# Altium project SAMA7D65-Curiosity.PrjPcb (part 5 of 12)

## Sheet 08 - Memories.SchDoc
size B; CompanyName: Microchip Technology Inc.; Organization: Microchip Technology; Address1: 2355 West Chandler Blvd.; Address2: Chandler, AZ  85224; Address4: USA; DocumentNumber: 8; SheetNumber: 8; SheetTotal: 15; SheetTitle: NAND, QSPI Flash Memories, SD Card
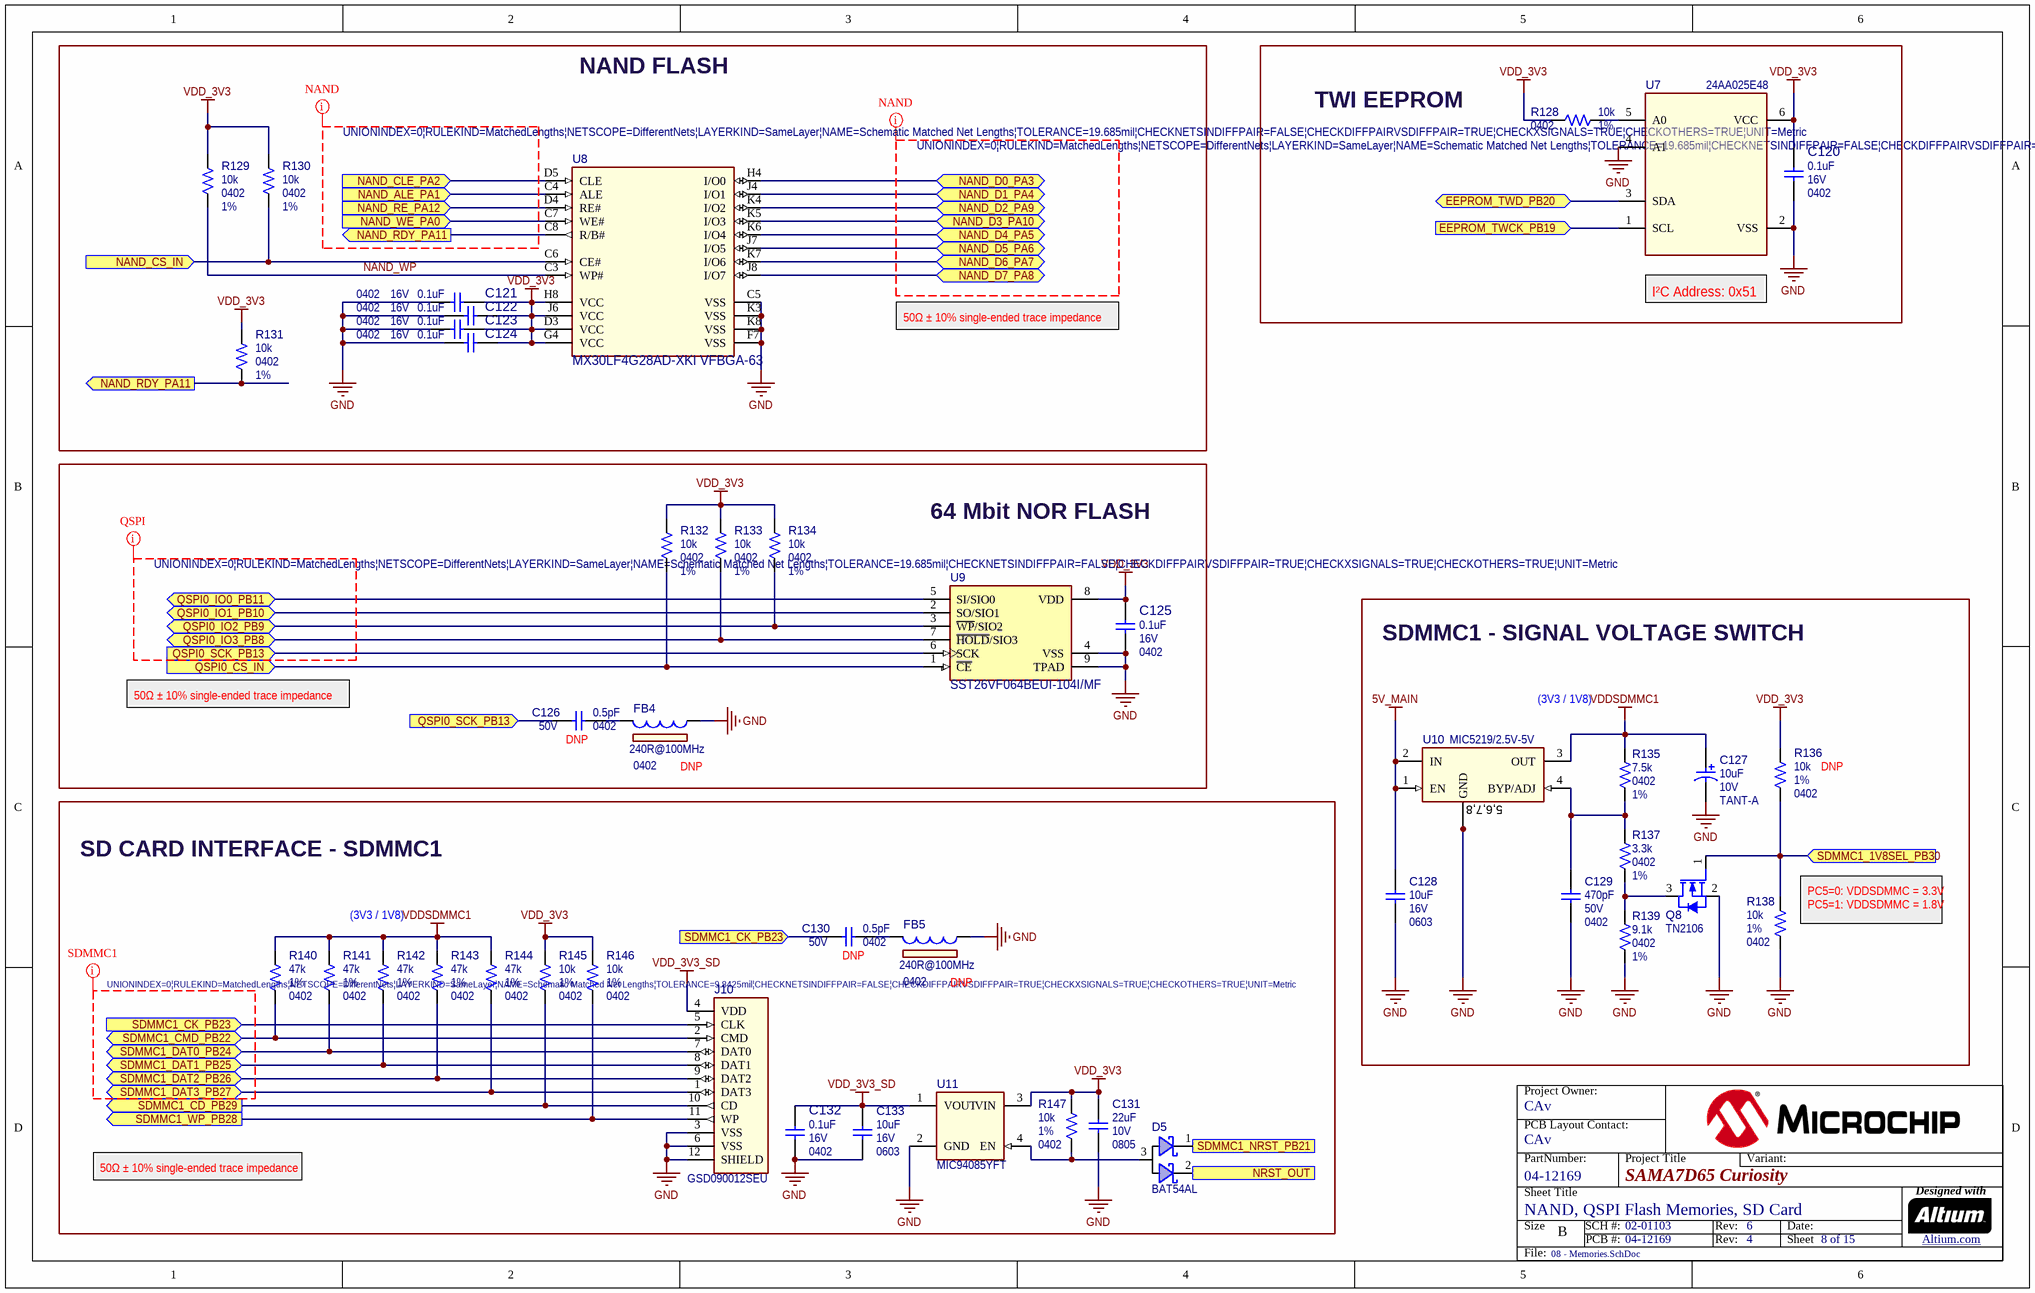
[diagram p7: 08 - Memories.SchDoc]

### Parts
C120  value 0.1uF  Voltage: 16V  Package: 0402  [CAP_C_0402]  (hidden comment: Capacitor NP)
C121  value 0.1uF  Voltage: 16V  Package: 0402  [CAP_C_0402]  (hidden comment: Capacitor NP)
C122  value 0.1uF  Voltage: 16V  Package: 0402  [CAP_C_0402]  (hidden comment: Capacitor NP)
C123  value 0.1uF  Voltage: 16V  Package: 0402  [CAP_C_0402]  (hidden comment: Capacitor NP)
C124  value 0.1uF  Voltage: 16V  Package: 0402  [CAP_C_0402]  (hidden comment: Capacitor NP)
C125  value 0.1uF  Voltage: 16V  Package: 0402  [CAP_C_0402]  (hidden comment: Capacitor NP)
C126  value 0.5pF  Voltage: 50V  Package: 0402  Populated: DNP  [CAP_C_0402]  (hidden comment: Capacitor NP)
C127  value 10uF  Voltage: 10V  Package: TANT-A  [CAP_TANT_A]  (hidden comment: Capacitor POL)
C128  value 10uF  Voltage: 16V  Package: 0603  [CAP_C_0603]  (hidden comment: Capacitor NP)
C129  value 470pF  Voltage: 50V  Package: 0402  [CAP_C_0402]  (hidden comment: Capacitor NP)
C130  value 0.5pF  Voltage: 50V  Package: 0402  Populated: DNP  [CAP_C_0402]  (hidden comment: Capacitor NP)
C131  value 22uF  Voltage: 10V  Package: 0805  [CAP_C_0805]  (hidden comment: Capacitor NP)
C132  value 0.1uF  Voltage: 16V  Package: 0402  [CAP_C_0402]  (hidden comment: Capacitor NP)
C133  value 10uF  Voltage: 16V  Package: 0603  [CAP_C_0603]  (hidden comment: Capacitor NP)
D5  value BAT54AL  [SOT-23-3]  (hidden comment: Diode Schottky Dual CA)
FB4  value 240R@100MHz  Package: 0402  Populated: DNP  [IND_C_0402]  (hidden comment: Ferrite Bead)
FB5  value 240R@100MHz  Package: 0402  Populated: DNP  [IND_C_0402]  (hidden comment: Ferrite Bead)
J10  Manufacturer Part Number 1: GSD090012SEU  [CON_SD_GSD090012SEU]  (hidden comment: SD-114-00841-68)
Q8  value TN2106  [SOT-23-3]  (hidden comment: Transistor MOS-N GSD)
R128  value 10k  Package: 0402  Tolerance: 1%  [RES_C_0402]  (hidden comment: Resistor)
R129  value 10k  Package: 0402  Tolerance: 1%  [RES_C_0402]  (hidden comment: Resistor)
R130  value 10k  Package: 0402  Tolerance: 1%  [RES_C_0402]  (hidden comment: Resistor)
R131  value 10k  Package: 0402  Tolerance: 1%  [RES_C_0402]  (hidden comment: Resistor)
R132  value 10k  Package: 0402  Tolerance: 1%  [RES_C_0402]  (hidden comment: Resistor)
R133  value 10k  Package: 0402  Tolerance: 1%  [RES_C_0402]  (hidden comment: Resistor)
R134  value 10k  Package: 0402  Tolerance: 1%  [RES_C_0402]  (hidden comment: Resistor)
R135  value 7.5k  Package: 0402  Tolerance: 1%  [RES_C_0402]  (hidden comment: Resistor)
R136  value 10k  Package: 0402  Tolerance: 1%  Populated: DNP  [RES_C_0402]  (hidden comment: Resistor)
R137  value 3.3k  Package: 0402  Tolerance: 1%  [RES_C_0402]  (hidden comment: Resistor)
R138  value 10k  Package: 0402  Tolerance: 1%  [RES_C_0402]  (hidden comment: Resistor)
R139  value 9.1k  Package: 0402  Tolerance: 1%  [RES_C_0402]  (hidden comment: Resistor)
R140  value 47k  Package: 0402  Tolerance: 1%  [RES_C_0402]  (hidden comment: Resistor)
R141  value 47k  Package: 0402  Tolerance: 1%  [RES_C_0402]  (hidden comment: Resistor)
R142  value 47k  Package: 0402  Tolerance: 1%  [RES_C_0402]  (hidden comment: Resistor)
R143  value 47k  Package: 0402  Tolerance: 1%  [RES_C_0402]  (hidden comment: Resistor)
R144  value 47k  Package: 0402  Tolerance: 1%  [RES_C_0402]  (hidden comment: Resistor)
R145  value 10k  Package: 0402  Tolerance: 1%  [RES_C_0402]  (hidden comment: Resistor)
R146  value 10k  Package: 0402  Tolerance: 1%  [RES_C_0402]  (hidden comment: Resistor)
R147  value 10k  Package: 0402  Tolerance: 1%  [RES_C_0402]  (hidden comment: Resistor)
U7  value 24AA025E48  [SOT-23-6]  (hidden comment: 24XXXX SOT-23-6)
U8  MX30LF4G28AD-XKI VFBGA-63  [VFBGA-63_P0.8_9x11x1]
U9  value SST26VF064BEUI-104I/MF  [WSON-8_6x5_EP3.4X4.0]  (hidden comment: SST26VF064B-104IMF)
U10  value MIC5219/2.5V-5V  [MSOP-8]  (hidden comment: MIC5219 MSOP-8)
U11  value MIC94085YFT  [MLF-4 0.85X0.85mm]  (hidden comment: MIC94085YFT MLF-4)

### Blocks framed on the sheet
NAND FLASH: C121-C124 R129-R131 U8
TWI EEPROM: C120 R128 U7
64 Mbit NOR FLASH: C125 C126 FB4 R132-R134 U9
SDMMC1 - SIGNAL VOLTAGE SWITCH: C127-C129 Q8 R135-R139 U10
SD CARD INTERFACE - SDMMC1: C130-C133 D5 FB5 J10 R140-R147 U11

### Ports
EEPROM_TWCK_PB19 (in), EEPROM_TWD_PB20 (bidir), NAND_ALE_PA1 (in), NAND_CLE_PA2 (in), NAND_CS_IN (in), NAND_D0_PA3 (bidir), NAND_D1_PA4 (bidir), NAND_D2_PA9 (bidir), NAND_D3_PA10 (bidir), NAND_D4_PA5 (bidir), NAND_D5_PA6 (bidir), NAND_D6_PA7 (bidir), NAND_D7_PA8 (bidir), NAND_RDY_PA11 (out), NAND_RE_PA12 (in), NAND_WE_PA0 (in), NRST_OUT (in), QSPI0_CS_IN (in), QSPI0_IO0_PB11 (bidir), QSPI0_IO1_PB10 (bidir), QSPI0_IO2_PB9 (bidir), QSPI0_IO3_PB8 (bidir), QSPI0_SCK_PB13 (in), SDMMC1_1V8SEL_PB30 (in), SDMMC1_CD_PB29 (out), SDMMC1_CK_PB23 (in), SDMMC1_CMD_PB22 (bidir), SDMMC1_DAT0_PB24 (bidir), SDMMC1_DAT1_PB25 (bidir), SDMMC1_DAT2_PB26 (bidir), SDMMC1_DAT3_PB27 (bidir), SDMMC1_NRST_PB21 (in), SDMMC1_WP_PB28 (out)

### Nets
5V_MAIN: C128.1 U10.1(EN) U10.2(IN)
GND: C120.2 C121.2 C122.2 C123.2 C124.2 C125.2 C127.2 C128.2 C129.1 C131.2 C132.2 C133.2 FB4.1 FB5.1 J10.3(VSS) J10.6(VSS) J10.12(SHIELD) Q8.2(S) R138.1 R139.1 U7.2(VSS) U7.4(A1) U8.C5(VSS) U8.F7(VSS) U8.K3(VSS) U8.K8(VSS) U9.4(VSS) U9.9(TPAD) U10.5(GND) U10.6(GND) U10.7(GND) U10.8(GND) U11.2(GND)
VDD_3V3: C120.1 C121.1 C122.1 C123.1 C124.1 C125.1 C131.1 R128.1 R129.2 R130.2 R131.2 R132.2 R133.2 R134.2 R136.2 R145.2 R146.2 R147.2 U7.6(VCC) U8.D3(VCC) U8.G4(VCC) U8.H8(VCC) U8.J6(VCC) U9.8(VDD) U11.3(VIN)
VDD_3V3_SD: C132.1 C133.1 J10.4(VDD) U11.1(VOUT)
VDDSDMMC1: C127.1 R135.2 R140.1 R141.1 R142.1 R143.1 R144.1 U10.3(OUT)
EEPROM_TWCK_PB19: U7.1(SCL) ; port EEPROM_TWCK_PB19
EEPROM_TWD_PB20: U7.3(SDA) ; port EEPROM_TWD_PB20
NAND_ALE_PA1: U8.C4(ALE) ; port NAND_ALE_PA1
NAND_CLE_PA2: U8.D5(CLE) ; port NAND_CLE_PA2
NAND_CS_IN: R130.1 U8.C6(CE#) ; port NAND_CS_IN
NAND_D0_PA3: U8.H4(I/O0) ; port NAND_D0_PA3
NAND_D1_PA4: U8.J4(I/O1) ; port NAND_D1_PA4
NAND_D2_PA9: U8.K4(I/O2) ; port NAND_D2_PA9
NAND_D3_PA10: U8.K5(I/O3) ; port NAND_D3_PA10
NAND_D4_PA5: U8.K6(I/O4) ; port NAND_D4_PA5
NAND_D5_PA6: U8.J7(I/O5) ; port NAND_D5_PA6
NAND_D6_PA7: U8.K7(I/O6) ; port NAND_D6_PA7
NAND_D7_PA8: U8.J8(I/O7) ; port NAND_D7_PA8
NAND_RDY_PA11: R131.1 U8.C8(R/B#) ; port NAND_RDY_PA11
NAND_RE_PA12: U8.D4(RE#) ; port NAND_RE_PA12
NAND_WE_PA0: U8.C7(WE#) ; port NAND_WE_PA0
NAND_WP: R129.1 U8.C3(WP#)
nRST_OUT: D5.2(K) ; port NRST_OUT
QSPI0_CS_IN: R132.1 U9.1(~{CE}) ; port QSPI0_CS_IN
QSPI0_IO0_PB11: U9.5(SI/SIO0) ; port QSPI0_IO0_PB11
QSPI0_IO1_PB10: U9.2(SO/SIO1) ; port QSPI0_IO1_PB10
QSPI0_IO2_PB9: R134.1 U9.3(~{WP}/SIO2) ; port QSPI0_IO2_PB9
QSPI0_IO3_PB8: R133.1 U9.7(~{HOLD}/SIO3) ; port QSPI0_IO3_PB8
QSPI0_SCK_PB13: C126.2 U9.6(SCK) ; port QSPI0_SCK_PB13
SDMMC1_1V8SEL_PB30: Q8.1(G) R136.1 R138.2 ; port SDMMC1_1V8SEL_PB30
SDMMC1_CD_PB29: J10.10(CD) R145.1 ; port SDMMC1_CD_PB29
SDMMC1_CK_PB23: C130.2 J10.5(CLK) ; port SDMMC1_CK_PB23
SDMMC1_CMD_PB22: J10.2(CMD) R140.2 ; port SDMMC1_CMD_PB22
SDMMC1_DAT0_PB24: J10.7(DAT0) R141.2 ; port SDMMC1_DAT0_PB24
SDMMC1_DAT1_PB25: J10.8(DAT1) R142.2 ; port SDMMC1_DAT1_PB25
SDMMC1_DAT2_PB26: J10.9(DAT2) R143.2 ; port SDMMC1_DAT2_PB26
SDMMC1_DAT3_PB27: J10.1(DAT3) R144.2 ; port SDMMC1_DAT3_PB27
SDMMC1_NRST_PB21: D5.1(K) ; port SDMMC1_NRST_PB21
SDMMC1_WP_PB28: J10.11(WP) R146.1 ; port SDMMC1_WP_PB28
NetC126_1: C126.1 FB4.2
NetC129_2: C129.2 R135.1 R137.2 U10.4(BYP/ADJ)
NetC130_1: C130.1 FB5.2
NetD5_3: D5.3(AA) R147.1 U11.4(EN)
NetQ8_3: Q8.3(D) R137.1 R139.2
NetR128_2: R128.2 U7.5(A0)

Not connected (* = marked no-connect by the designer): U8 A1(NC) A2(NC) A9(NC) A10(NC) B1(NC) B9(NC) B10(NC) D6(NC) D7(NC) D8(NC) E3(NC) E4(NC) E5(NC) E6(NC) E7(NC) E8(NC) F3(NC) F4(NC) F5(NC) F6(NC) F8(NC) G3(DNU) G6(NC) G7(NC) G8(DNU) H3(NC) H5(NC) H6(NC) H7(NC) J3(NC) J5(NC) L1(NC) L2(NC) L9(NC) L10(NC) M1(NC) M2(NC) M9(NC) M10(NC)

### Layout directives
rule Matched Net Lengths [Tolerance = 0.5mm]; net class NAND: (no net found under the mark)
net class QSPI1; rule Matched Net Lengths [Tolerance = 0.5mm]: (no net found under the mark)
net class SDMMC1; rule Matched Net Lengths [Tolerance = 0.25mm]: (no net found under the mark)

### Notes on the sheet
- (near U7) I²C Address: 0x51
- 50Ω ± 10% single-ended trace impedance
- (3V3 / 1V8)
- (near R138) PC5=0: VDDSDMMC = 3.3V
  PC5=1: VDDSDMMC = 1.8V
- Project Owner:
- PCB Layout Contact:
- PartNumber:
- Project Title
- Variant:
- Sheet Title
- Size
- B
- SCH #:
- PCB #:
- Rev:
- Date:
- Sheet
- Designed with
- Altium.com <http://go.altium.com/MicrochipLandingPage_Evaluation.html>
- File:
- (in symbol MIC6596) 5,6,7,8

### Library data of the parts
C120 C132 = CAP1033: Manufacturer 1: Hottech; Manufacturer Part Number 1: C1005B104K160NT; Description_: CAP CER 0.1uF 16V 10% X7R SMD 0402; Dev Tools Status: Production; Tolerance: 10%; Type: Ceramic; Owner: Sompoch Loboonlert; Populated: Yes; Temperature Coefficient: X7R; Restricted Sourcing: No; MCHP-ID: CAP1033; Revision: 10; Symbol: Capacitor NP; Status: MCL Design; ComponentLink1URL: https://chn-vm-apps.microchip.com/mchprepo/parts/Datasheets/L0005E.pdf; ComponentLink1Description: SVN Datasheet; ComponentLink2URL: C:\ALTIUM_WORK\00001_MCHP-CDB\Datasheets\L0005E.pdf; ComponentLink2Description: Local Datasheet; ComponentLink3URL: C:\ALTIUM_WORK\00001_MCHP-CDB\Library\LibraryRefs\Capacitor NP.SchLib; ComponentLink3Description: Open Symbol; ComponentLink4URL: C:\ALTIUM_WORK\00001_MCHP-CDB\Library\Footprints\CAP_C_0402.PcbLib; ComponentLink4Description: Open Footprint; ComponentLink5Description: Open Footprint 2; ComponentLink6Description: Open Footprint 3; ComponentLink7Description: Open Footprint 4; Operating Temperature: -55C to +125C; Category: Capacitor; Manufacturer 2: KEMET; Manufacturer Part Number 2: C0402C104K4RAC7867; Manufacturer 3: Samsung Electro-Mechanics; Manufacturer Part Number 3: CL05B104KO5NNNC; Supplier 1: Hottech; Supplier Part Number 1: C1005B104K160NT; Supplier 2: Digi-Key; Supplier Part Number 2: 399-C0402C104K4RAC7867TR-ND; Supplier 3: Digi-Key; Supplier Part Number 3: 1276-1001-1-ND; Quantity Override: 1; Manufacturer 4: Würth Elektronik; Manufacturer Part Number 4: 885012205037; Manufacturer 5: Samsung Electro-Mechanics; Manufacturer Part Number 5: CL05B104KO5NNND; Manufacturer 6: Samsung Electro-Mechanics; Manufacturer Part Number 6: CL05B104KO5NNNO; Manufacturer 7: Yageo; Manufacturer Part Number 7: CC0402KRX7R7BB104; Supplier 4: Digi-Key; Supplier Part Number 4: 732-7532-1-ND; Supplier 5: Mouser; Supplier Part Number 5: 187-CL05B104KO5NNND; Supplier 6: Samsung Electro-Mechanics; Supplier Part Number 6: CL05B104KO5NNNO; Supplier 7: Yageo; Supplier Part Number 7: CC0402KRX7R7BB104
C121-C125 = CAP1033: Manufacturer 1: Hottech; Manufacturer Part Number 1: C1005B104K160NT; Description_: CAP CER 0.1uF 16V 10% X7R SMD 0402; Dev Tools Status: Production; Tolerance: 10%; Owner: Sompoch Loboonlert; Populated: Yes; Temperature Coefficient: X7R; Type: Ceramic; Restricted Sourcing: No; MCHP-ID: CAP1033; Revision: 10; Symbol: Capacitor NP; Status: MCL Design; ComponentLink1URL: https://chn-vm-apps.microchip.com/mchprepo/parts/Datasheets/L0005E.pdf; ComponentLink1Description: SVN Datasheet; ComponentLink2URL: C:\ALTIUM_WORK\00001_MCHP-CDB\Datasheets\L0005E.pdf; ComponentLink2Description: Local Datasheet; ComponentLink3URL: C:\ALTIUM_WORK\00001_MCHP-CDB\Library\LibraryRefs\Capacitor NP.SchLib; ComponentLink3Description: Open Symbol; ComponentLink4URL: C:\ALTIUM_WORK\00001_MCHP-CDB\Library\Footprints\CAP_C_0402.PcbLib; ComponentLink4Description: Open Footprint; ComponentLink5Description: Open Footprint 2; ComponentLink6Description: Open Footprint 3; ComponentLink7Description: Open Footprint 4; Operating Temperature: -55C to +125C; Category: Capacitor; Supplier 1: Hottech; Supplier Part Number 1: C1005B104K160NT; Quantity Override: 1; Manufacturer 2: KEMET; Manufacturer Part Number 2: C0402C104K4RAC7867; Manufacturer 3: Samsung Electro-Mechanics; Manufacturer Part Number 3: CL05B104KO5NNNC; Manufacturer 4: Würth Elektronik; Manufacturer Part Number 4: 885012205037; Manufacturer 5: Samsung Electro-Mechanics; Manufacturer Part Number 5: CL05B104KO5NNND; Manufacturer 6: Samsung Electro-Mechanics; Manufacturer Part Number 6: CL05B104KO5NNNO; Manufacturer 7: Yageo; Manufacturer Part Number 7: CC0402KRX7R7BB104; Supplier 2: Digi-Key; Supplier Part Number 2: 399-C0402C104K4RAC7867TR-ND; Supplier 3: Digi-Key; Supplier Part Number 3: 1276-1001-1-ND; Supplier 4: Digi-Key; Supplier Part Number 4: 732-7532-1-ND; Supplier 5: Mouser; Supplier Part Number 5: 187-CL05B104KO5NNND; Supplier 6: Samsung Electro-Mechanics; Supplier Part Number 6: CL05B104KO5NNNO; Supplier 7: Yageo; Supplier Part Number 7: CC0402KRX7R7BB104
C126 C130 = CAP0274: Manufacturer 1: KEMET; Manufacturer Part Number 1: C0402C508C5GACTU; Description_: CAP CER 0.5pF 50V 0.25pF NP0 SMD 0402; Dev Tools Status: Production; Tolerance: 0.25pF; Temperature Coefficient: NP0; Type: Ceramic; Restricted Sourcing: No; MCHP-ID: CAP0274; Revision: 2; Symbol: Capacitor NP; Status: MCL Design; ComponentLink1URL: https://chn-vm-apps.microchip.com/mchprepo/parts/Datasheets/MLCC_ordering_code.pdf; ComponentLink1Description: SVN Datasheet; ComponentLink2URL: C:\ALTIUM_WORK\00001_MCHP-CDB\Datasheets\MLCC_ordering_code.pdf; ComponentLink2Description: Local Datasheet; ComponentLink3URL: C:\ALTIUM_WORK\00001_MCHP-CDB\Library\LibraryRefs\Capacitor NP.SchLib; ComponentLink3Description: Open Symbol; ComponentLink4URL: C:\ALTIUM_WORK\00001_MCHP-CDB\Library\Footprints\CAP_C_0402.PcbLib; ComponentLink4Description: Open Footprint; ComponentLink5Description: Open Footprint 2; ComponentLink6Description: Open Footprint 3; ComponentLink7Description: Open Footprint 4; Operating Temperature: -55C to +125C; Category: Capacitor; Manufacturer 2: KYOCERA AVX; Manufacturer Part Number 2: 04025A0R5CAT2A; Manufacturer 3: Yageo; Manufacturer Part Number 3: CC0402CRNPO9BNR50; Supplier 1: Digi-Key; Supplier Part Number 1: 399-1000-2-ND; Supplier 2: Digi-Key; Supplier Part Number 2: 478-1057-2-ND; Supplier 3: Digi-Key; Supplier Part Number 3: 311-1001-2-ND; Quantity Override: 1
C127 = CAP0306: Capacitor; Manufacturer 1: Nichicon; Manufacturer Part Number 1: F931A106MAA; Description_: CAP TANT 10uF 10V 20% 3.8Ohm SMD A; Dev Tools Status: Production; Tolerance: 20%; ESR: 3.8Ohm; Type: Tantalum; Owner: Petnarong Chaijaroong; Populated: YES; MCHP-ID: CAP0306; Revision: 1; Symbol: Capacitor POL; Status: MCL Design; ComponentLink1URL: https://chn-vm-apps.microchip.com/mchprepo/parts/Datasheets/e-f93.pdf; ComponentLink1Description: SVN Datasheet; ComponentLink2URL: C:\ALTIUM_WORK\00001_MCHP-CDB\Datasheets\e-f93.pdf; ComponentLink2Description: Local Datasheet; ComponentLink3URL: C:\ALTIUM_WORK\00001_MCHP-CDB\Library\LibraryRefs\Capacitor POL.SchLib; ComponentLink3Description: Open Symbol; ComponentLink4URL: C:\ALTIUM_WORK\00001_MCHP-CDB\Library\Footprints\CAP_TANT_A.PcbLib; ComponentLink4Description: Open Footprint; ComponentLink5Description: Open Footprint 2; ComponentLink6Description: Open Footprint 3; ComponentLink7Description: Open Footprint 4; Operating Temperature: -55C to +125C; Category: Capacitor; Manufacturer 2: KEMET; Manufacturer Part Number 2: T491A106M010AT; Manufacturer 3: KEMET; Manufacturer Part Number 3: T491A106M010AG; Supplier 1: Digi-Key; Supplier Part Number 1: 493-2351-1-ND; Supplier 2: KEMET; Supplier Part Number 2: T491A106M010AT; Supplier 3: KEMET; Supplier Part Number 3: T491A106M010AG; Quantity Override: 1
C128 C133 = CAP2397: Manufacturer 1: Murata; Manufacturer Part Number 1: GRT188R61C106KE13D; Description_: CAP CER 10uF 16V 10% X5R SMD 0603 AEC-Q200; Dev Tools Status: Design; Tolerance: 10%; Temperature Coefficient: X5R; Type: Ceramic; Populated: YES; Owner: Sam Charles; MCHP-ID: CAP2397; Revision: 1; Symbol: Capacitor NP; Status: MCL Design; ComponentLink1URL: https://chn-vm-apps.microchip.com/mchprepo/parts/Datasheets/GRT188R61C106KE13-01.pdf; ComponentLink1Description: SVN Datasheet; ComponentLink2URL: C:\ALTIUM_WORK\00001_MCHP-CDB\Datasheets\GRT188R61C106KE13-01.pdf; ComponentLink2Description: Local Datasheet; ComponentLink3URL: C:\ALTIUM_WORK\00001_MCHP-CDB\Library\LibraryRefs\Capacitor NP.SchLib; ComponentLink3Description: Open Symbol; ComponentLink4URL: C:\ALTIUM_WORK\00001_MCHP-CDB\Library\Footprints\CAP_C_0603.PcbLib; ComponentLink4Description: Open Footprint; ComponentLink5Description: Open Footprint 2; ComponentLink6Description: Open Footprint 3; ComponentLink7Description: Open Footprint 4; Operating Temperature: -55°C ~ 85°C; Category: Capacitor; Supplier 1: Digi-Key; Supplier Part Number 1: 490-12317-1-ND; Quantity Override: 1
C129 = CAP1382: Manufacturer 1: Murata; Manufacturer Part Number 1: GRM1555C1H471JA01D; Description_: CAP CER 470pF 50V 5% NP0 SMD 0402; Dev Tools Status: Production; Tolerance: 5%; Temperature Coefficient: NP0; Type: Ceramic; Owner: Duane Burt; Populated: YES; Restricted Sourcing: No; MCHP-ID: CAP1382; Revision: 3; Symbol: Capacitor NP; Status: MCL Design; ComponentLink1URL: https://chn-vm-apps.microchip.com/mchprepo/parts/Datasheets/c02e.pdf; ComponentLink1Description: SVN Datasheet; ComponentLink2URL: C:\ALTIUM_WORK\00001_MCHP-CDB\Datasheets\c02e.pdf; ComponentLink2Description: Local Datasheet; ComponentLink3URL: C:\ALTIUM_WORK\00001_MCHP-CDB\Library\LibraryRefs\Capacitor NP.SchLib; ComponentLink3Description: Open Symbol; ComponentLink4URL: C:\ALTIUM_WORK\00001_MCHP-CDB\Library\Footprints\CAP_C_0402.PcbLib; ComponentLink4Description: Open Footprint; ComponentLink5Description: Open Footprint 2; ComponentLink6Description: Open Footprint 3; ComponentLink7Description: Open Footprint 4; Operating Temperature: -55C to +125C; Category: Capacitor; Manufacturer 2: Yageo; Manufacturer Part Number 2: CC0402JRNPO9BN471; Supplier 1: Digi-Key; Supplier Part Number 1: 490-1297-1-ND; Supplier 2: Yageo; Supplier Part Number 2: CC0402JRNPO9BN471; Quantity Override: 1
C131 = CAP1618: Manufacturer 1: TDK Corporation; Manufacturer Part Number 1: C2012X7S1A226M125AC; Description_: CAP CER 22uF 10V 20% X7S SMD 0805; Dev Tools Status: Production; Tolerance: 20%; Temperature Coefficient: X7S; Type: Ceramic; Populated: YES; Owner: Razvan Cristescu; Restricted Sourcing: No; MCHP-ID: CAP1618; Revision: 3; Symbol: Capacitor NP; Status: MCL Design; ComponentLink1URL: https://chn-vm-apps.microchip.com/mchprepo/parts/Datasheets/mlcc_commercial_general_en.pdf; ComponentLink1Description: SVN Datasheet; ComponentLink2URL: C:\ALTIUM_WORK\00001_MCHP-CDB\Datasheets\mlcc_commercial_general_en.pdf; ComponentLink2Description: Local Datasheet; ComponentLink3URL: C:\ALTIUM_WORK\00001_MCHP-CDB\Library\LibraryRefs\Capacitor NP.SchLib; ComponentLink3Description: Open Symbol; ComponentLink4URL: C:\ALTIUM_WORK\00001_MCHP-CDB\Library\Footprints\CAP_C_0805.PcbLib; ComponentLink4Description: Open Footprint; ComponentLink5Description: Open Footprint 2; ComponentLink6Description: Open Footprint 3; ComponentLink7Description: Open Footprint 4; Operating Temperature: -55C to +125C; Category: Capacitor; Supplier 1: Digi-Key; Supplier Part Number 1: 445-14560-1-ND; Quantity Override: 1
D5 = DIODE1603: Manufacturer 1: ON Semiconductor; Manufacturer Part Number 1: BAT54ALT1G; Description_: DIO SCTKY ARRAY BAT54AL 800mV 200mA 30V SMD SOT-23-3; Dev Tools Status: Design; Type: Schottky Array; Forward Current: 200mA; Power: 225mW; Reverse Current: 0.5uA; Reverse Recovery Time: 5ns; Reverse Voltage: 30V; Owner: Ciprian Abramov; Populated: YES; MCHP-ID: DIODE1603; Revision: 1; Symbol: Diode Schottky Dual CA; Status: MCL Design; Package: SOT-23-3; ComponentLink1URL: https://chn-vm-apps.microchip.com/mchprepo/parts/Datasheets/BAT54ALT1-D.PDF; ComponentLink1Description: SVN Datasheet; ComponentLink2URL: C:\ALTIUM_WORK\00001_MCHP-CDB\Datasheets\BAT54ALT1-D.PDF; ComponentLink2Description: Local Datasheet; ComponentLink3URL: C:\ALTIUM_WORK\00001_MCHP-CDB\Library\LibraryRefs\Diode Schottky Dual CA.SchLib; ComponentLink3Description: Open Symbol; ComponentLink4URL: C:\ALTIUM_WORK\00001_MCHP-CDB\Library\Footprints\SOT-23-3.PcbLib; ComponentLink4Description: Open Footprint; ComponentLink5Description: Open Footprint 2; ComponentLink6Description: Open Footprint 3; ComponentLink7Description: Open Footprint 4; Operating Temperature: -55C to +150C; Category: Diode; Supplier 1: Digi-Key; Supplier Part Number 1: BAT54ALT1GOSCT-ND; Quantity Override: 1
FB4 FB5 = FB1020: Manufacturer 1: TDK Corporation; Manufacturer Part Number 1: MMZ1005Y241CT000; MCHP-ID: FB1020; Description_: FERRITE 240R @100MHz 300mA SMD 0402; Dev Tools Status: Design; Owner: Joerg Buehrer; DCR: 260 mR; Revision: 1; Symbol: Ferrite Bead; Status: MCL Design; ComponentLink1URL: https://chn-vm-apps.microchip.com/mchprepo/parts/Datasheets/beads_commercial_signal_mmz1005_en.pdf; ComponentLink1Description: SVN Datasheet; ComponentLink2URL: C:\ALTIUM_WORK\00001_MCHP-CDB\Datasheets\beads_commercial_signal_mmz1005_en.pdf; ComponentLink2Description: Local Datasheet; ComponentLink3URL: C:\ALTIUM_WORK\00001_MCHP-CDB\Library\LibraryRefs\Ferrite Bead.SchLib; ComponentLink3Description: Open Symbol; ComponentLink4URL: C:\ALTIUM_WORK\00001_MCHP-CDB\Library\Footprints\IND_C_0402.PcbLib; ComponentLink4Description: Open Footprint; ComponentLink5Description: Open Footprint 2; ComponentLink6Description: Open Footprint 3; ComponentLink7Description: Open Footprint 4; Operating Temperature: -55°C ~ 125°C; Type: Ferrite Bead; Category: Inductor; Manufacturer 2: TDK Corporation; Manufacturer Part Number 2: MMZ1005Y241CT000; Supplier 1: Digi-Key; Supplier Part Number 1: 445-2153-1-ND; Supplier 2: Mouser; Supplier Part Number 2: 810-MMZ1005Y241CT000; Quantity Override: 1
J10 = CON2490: Manufacturer 1: Amphenol ICC (Commercial Products); Value: SD Card 11P Receptacle; Description_: CON FLASH SD 9+2P PUSH-PUSH SMD R/A; Dev Tools Status: Production; Owner: Ciprian Abramov; Populated: YES; Voltage: 5V; Current: 0.5A; Restricted Sourcing: No; MCHP-ID: CON2490; Revision: 2; Symbol: CON SD CARD 11P_amphenol; Status: MCL Design; ComponentLink1URL: https://chn-vm-apps.microchip.com/mchprepo/parts/Datasheets/gsd09001xseu.pdf; ComponentLink1Description: SVN Datasheet; ComponentLink2URL: C:\ALTIUM_WORK\00001_MCHP-CDB\Datasheets\gsd09001xseu.pdf; ComponentLink2Description: Local Datasheet; ComponentLink3URL: C:\ALTIUM_WORK\00001_MCHP-CDB\Library\LibraryRefs\CON SD CARD 11P_amphenol.SchLib; ComponentLink3Description: Open Symbol; ComponentLink4URL: C:\ALTIUM_WORK\00001_MCHP-CDB\Library\Footprints\CON_SD_GSD090012SEU.PcbLib; ComponentLink4Description: Open Footprint; ComponentLink5Description: Open Footprint 2; ComponentLink6Description: Open Footprint 3; ComponentLink7Description: Open Footprint 4; Type: Flash Card; Category: Connector; Supplier 1: Digi-Key; Supplier Part Number 1: 664-GSD090012SEUCT-ND; Quantity Override: 1; Operating Temperature: -40C to +90C; Assembly Type: SMD
Q8 = MIC7420: Transistor MOS; Manufacturer 1: Microchip Technology; Manufacturer Part Number 1: TN2106K1-G; Description_: MCHP ANALOG MOSFET N-CH TN2106 60V 280mA 360mW 2.5R SOT23-3; Type: MOSFET; Dev Tools Status: Production; Owner: Ilie Galan; Populated: YES; MCHP-ID: MIC7420; Symbol: Transistor MOS-N GSD; Status: MCL Design; Revision: 1; Category: MCHP-Analog; ComponentLink1URL: https://chn-vm-apps.microchip.com/mchprepo/parts/Datasheets/TN2106 B080913.pdf; ComponentLink1Description: SVN Datasheet; ComponentLink2URL: C:\ALTIUM_WORK\00001_MCHP-CDB\Datasheets\TN2106 B080913.pdf; ComponentLink2Description: Local Datasheet; ComponentLink3URL: C:\ALTIUM_WORK\00001_MCHP-CDB\Library\LibraryRefs\Transistor MOS-N GSD.SchLib; ComponentLink3Description: Open Symbol; ComponentLink4URL: C:\ALTIUM_WORK\00001_MCHP-CDB\Library\Footprints\SOT-23-3.PcbLib; ComponentLink4Description: Open Footprint; ComponentLink5Description: Open Footprint 2; ComponentLink6Description: Open Footprint 3; ComponentLink7Description: Open Footprint 4; Supplier 1: Microchip Technology; Supplier Part Number 1: TN2106K1-G; Operating Temperature: -55C to +150C; Quantity Override: 1
R128 = RSMT1019: Manufacturer 1: Panasonic; Manufacturer Part Number 1: ERJ-2RKF1002X; Description_: RES TKF 10k 1% 1/10W SMD 0402; Dev Tools Status: Production; Voltage: 50V; Temperature Coeffcient: 100ppm/C; Power: 1/10W; Owner: Brent Lanphear; Populated: Yes; MCHP-ID: RSMT1019; Revision: 2; Symbol: Resistor; Status: MCL Design; ComponentLink1URL: https://chn-vm-apps.microchip.com/mchprepo/parts/Datasheets/AOA0000CE2.pdf; ComponentLink1Description: SVN Datasheet; ComponentLink2URL: C:\ALTIUM_WORK\00001_MCHP-CDB\Datasheets\AOA0000CE2.pdf; ComponentLink2Description: Local Datasheet; ComponentLink3URL: C:\ALTIUM_WORK\00001_MCHP-CDB\Library\LibraryRefs\Resistor.SchLib; ComponentLink3Description: Open Symbol; ComponentLink4URL: C:\ALTIUM_WORK\00001_MCHP-CDB\Library\Footprints\RES_C_0402.PcbLib; ComponentLink4Description: Open Footprint; ComponentLink5Description: Open Footprint 2; ComponentLink6Description: Open Footprint 3; ComponentLink7Description: Open Footprint 4; Operating Temperature: -55C to +155C; Category: Resistor; Type: RES SMD; Composition: TKF; Supplier 1: Digi-Key; Supplier Part Number 1: P10.0KLCT-ND; Quantity Override: 1
R129-R134 = RSMT1019: Manufacturer 1: Panasonic; Manufacturer Part Number 1: ERJ-2RKF1002X; Description_: RES TKF 10k 1% 1/10W SMD 0402; Dev Tools Status: Production; Voltage: 50V; Power: 1/10W; Owner: Brent Lanphear; Populated: Yes; Temperature Coefficient: 100ppm/C; MCHP-ID: RSMT1019; Revision: 2; Symbol: Resistor; Status: MCL Design; ComponentLink1URL: https://chn-vm-apps.microchip.com/mchprepo/parts/Datasheets/AOA0000CE2.pdf; ComponentLink1Description: SVN Datasheet; ComponentLink2URL: C:\ALTIUM_WORK\00001_MCHP-CDB\Datasheets\AOA0000CE2.pdf; ComponentLink2Description: Local Datasheet; ComponentLink3URL: C:\ALTIUM_WORK\00001_MCHP-CDB\Library\LibraryRefs\Resistor.SchLib; ComponentLink3Description: Open Symbol; ComponentLink4URL: C:\ALTIUM_WORK\00001_MCHP-CDB\Library\Footprints\RES_C_0402.PcbLib; ComponentLink4Description: Open Footprint; ComponentLink5Description: Open Footprint 2; ComponentLink6Description: Open Footprint 3; ComponentLink7Description: Open Footprint 4; Operating Temperature: -55C to +155C; Category: Resistor; Type: RES SMD; Composition: TKF; Supplier 1: Digi-Key; Supplier Part Number 1: P10.0KLCT-ND; Quantity Override: 1
R135 = RES1458: Manufacturer 1: KOA Speer; Manufacturer Part Number 1: RK73H1ETTP7501F; Description_: RES TKF 7.5k 1% 1/16W SMD 0402; Dev Tools Status: Production; Temperature Coefficient: 100ppm/C; Circuit Type: Isolated; Power: 1/16W; Owner: Stephen Humberd; Populated: YES; MCHP-ID: RES1458; Revision: 1; Symbol: Resistor; Status: MCL Design; ComponentLink1URL: https://chn-vm-apps.microchip.com/mchprepo/parts/Datasheets/RK73H.pdf; ComponentLink1Description: SVN Datasheet; ComponentLink2URL: C:\ALTIUM_WORK\00001_MCHP-CDB\Datasheets\RK73H.pdf; ComponentLink2Description: Local Datasheet; ComponentLink3URL: C:\ALTIUM_WORK\00001_MCHP-CDB\Library\LibraryRefs\Resistor.SchLib; ComponentLink3Description: Open Symbol; ComponentLink4URL: C:\ALTIUM_WORK\00001_MCHP-CDB\Library\Footprints\RES_C_0402.PcbLib; ComponentLink4Description: Open Footprint; ComponentLink5Description: Open Footprint 2; ComponentLink6Description: Open Footprint 3; ComponentLink7Description: Open Footprint 4; Operating Temperature: -55C to +155C; Category: Resistor; Type: RES SMD; Composition: TF; Supplier 1: Mouser; Supplier Part Number 1: 660-RK73H1ETTP7501F; Quantity Override: 1
R136 = RSMT1019: Manufacturer 1: Panasonic; Manufacturer Part Number 1: ERJ-2RKF1002X; Description_: RES TKF 10k 1% 1/10W SMD 0402; Dev Tools Status: Production; Voltage: 50V; Temperature Coeffcient: 100ppm/C; Power: 1/10W; Owner: Brent Lanphear; MCHP-ID: RSMT1019; Revision: 2; Symbol: Resistor; Status: MCL Design; ComponentLink1URL: https://chn-vm-apps.microchip.com/mchprepo/parts/Datasheets/AOA0000CE2.pdf; ComponentLink1Description: SVN Datasheet; ComponentLink2URL: C:\ALTIUM_WORK\00001_MCHP-CDB\Datasheets\AOA0000CE2.pdf; ComponentLink2Description: Local Datasheet; ComponentLink3URL: C:\ALTIUM_WORK\00001_MCHP-CDB\Library\LibraryRefs\Resistor.SchLib; ComponentLink3Description: Open Symbol; ComponentLink4URL: C:\ALTIUM_WORK\00001_MCHP-CDB\Library\Footprints\RES_C_0402.PcbLib; ComponentLink4Description: Open Footprint; ComponentLink5Description: Open Footprint 2; ComponentLink6Description: Open Footprint 3; ComponentLink7Description: Open Footprint 4; Operating Temperature: -55C to +155C; Category: Resistor; Type: RES SMD; Composition: TKF; Supplier 1: Digi-Key; Supplier Part Number 1: P10.0KLCT-ND; Quantity Override: 1
R137 = RES2130: Manufacturer 1: Panasonic - ECG; Manufacturer Part Number 1: ERJ-2RKF3301X; Description_: RES TKF 3.3k 1% 1/10W SMD 0402; Dev Tools Status: Production; Voltage: 50V; Temperature Coefficient: 100ppm/C; Power: 1/10W; Owner: Mike Ragsdale; Populated: YES; MCHP-ID: RES2130; Revision: 1; Symbol: Resistor; Status: MCL Design; ComponentLink1URL: https://chn-vm-apps.microchip.com/mchprepo/parts/Datasheets/AOA0000C304.pdf; ComponentLink1Description: SVN Datasheet; ComponentLink2URL: C:\ALTIUM_WORK\00001_MCHP-CDB\Datasheets\AOA0000C304.pdf; ComponentLink2Description: Local Datasheet; ComponentLink3URL: C:\ALTIUM_WORK\00001_MCHP-CDB\Library\LibraryRefs\Resistor.SchLib; ComponentLink3Description: Open Symbol; ComponentLink4URL: C:\ALTIUM_WORK\00001_MCHP-CDB\Library\Footprints\RES_C_0402.PcbLib; ComponentLink4Description: Open Footprint; ComponentLink5Description: Open Footprint 2; ComponentLink6Description: Open Footprint 3; ComponentLink7Description: Open Footprint 4; Operating Temperature: -55C to +155C; Category: Resistor; Type: RES SMD; Composition: TKF; Supplier 1: Digi-Key; Supplier Part Number 1: P3.30KLTR-ND; Quantity Override: 1
R138 R145-R147 = RSMT1019: Manufacturer 1: Panasonic; Manufacturer Part Number 1: ERJ-2RKF1002X; Description_: RES TKF 10k 1% 1/10W SMD 0402; Dev Tools Status: Production; Voltage: 50V; Temperature Coeffcient: 100ppm/C; Power: 1/10W; Owner: Brent Lanphear; Populated: YES; MCHP-ID: RSMT1019; Revision: 2; Symbol: Resistor; Status: MCL Design; ComponentLink1URL: https://chn-vm-apps.microchip.com/mchprepo/parts/Datasheets/AOA0000CE2.pdf; ComponentLink1Description: SVN Datasheet; ComponentLink2URL: C:\ALTIUM_WORK\00001_MCHP-CDB\Datasheets\AOA0000CE2.pdf; ComponentLink2Description: Local Datasheet; ComponentLink3URL: C:\ALTIUM_WORK\00001_MCHP-CDB\Library\LibraryRefs\Resistor.SchLib; ComponentLink3Description: Open Symbol; ComponentLink4URL: C:\ALTIUM_WORK\00001_MCHP-CDB\Library\Footprints\RES_C_0402.PcbLib; ComponentLink4Description: Open Footprint; ComponentLink5Description: Open Footprint 2; ComponentLink6Description: Open Footprint 3; ComponentLink7Description: Open Footprint 4; Operating Temperature: -55C to +155C; Category: Resistor; Type: RES SMD; Composition: TKF; Supplier 1: Digi-Key; Supplier Part Number 1: P10.0KLCT-ND; Quantity Override: 1
R139 = RES1513: Manufacturer 1: Panasonic Electronic Components; Manufacturer Part Number 1: ERJ-2RKF9101X; Description_: RES TKF 9.1k 1% 1/10W SMD 0402; Dev Tools Status: Production; Voltage: 50V; Temperature Coefficient: 100ppm/C; Power: 1/10W; Populated: YES; MCHP-ID: RES1513; Revision: 1; Symbol: RESISTOR; Status: MCL Design; ComponentLink1URL: https://chn-vm-apps.microchip.com/mchprepo/parts/Datasheets/AOA0000CE2.pdf; ComponentLink1Description: SVN Datasheet; ComponentLink2URL: C:\ALTIUM_WORK\00001_MCHP-CDB\Datasheets\AOA0000CE2.pdf; ComponentLink2Description: Local Datasheet; ComponentLink3URL: C:\ALTIUM_WORK\00001_MCHP-CDB\Library\LibraryRefs\RESISTOR.SchLib; ComponentLink3Description: Open Symbol; ComponentLink4URL: C:\ALTIUM_WORK\00001_MCHP-CDB\Library\Footprints\RES_C_0402.PcbLib; ComponentLink4Description: Open Footprint; ComponentLink5Description: Open Footprint 2; ComponentLink6Description: Open Footprint 3; ComponentLink7Description: Open Footprint 4; Operating Temperature: -55C to +155C; Category: Resistor; Type: RES SMD; Composition: TKF; Supplier 1: Digi-Key; Supplier Part Number 1: P9.10KLCT-ND; Quantity Override: 1
R140-R144 = RES2131: Manufacturer 1: Panasonic - ECG; Manufacturer Part Number 1: ERJ-2RKF4702X; Description_: RES TKF 47k 1% 1/10W SMD 0402; Dev Tools Status: Design; Voltage: 50V; Temperature Coeffcient: 100ppm/C; Power: 1/10W; Owner: Mike Ragsdale; Populated: YES; MCHP-ID: RES2131; Revision: 0; Symbol: Resistor; Status: MCL Design; ComponentLink1URL: https://chn-vm-apps.microchip.com/mchprepo/parts/Datasheets/AOA0000C304.pdf; ComponentLink1Description: SVN Datasheet; ComponentLink2URL: C:\ALTIUM_WORK\00001_MCHP-CDB\Datasheets\AOA0000C304.pdf; ComponentLink2Description: Local Datasheet; ComponentLink3URL: C:\ALTIUM_WORK\00001_MCHP-CDB\Library\LibraryRefs\Resistor.SchLib; ComponentLink3Description: Open Symbol; ComponentLink4URL: C:\ALTIUM_WORK\00001_MCHP-CDB\Library\Footprints\RES_C_0402.PcbLib; ComponentLink4Description: Open Footprint; ComponentLink5Description: Open Footprint 2; ComponentLink6Description: Open Footprint 3; ComponentLink7Description: Open Footprint 4; Operating Temperature: -55C to +155C; Category: Resistor; Type: RES SMD; Composition: TKF; Supplier 1: Digi-Key; Supplier Part Number 1: P47.0KLTR-ND; Quantity Override: 1
U7 = MIC7407: Manufacturer 1: Microchip Technology; Manufacturer Part Number 1: 24AA025E48T-I/OT; Description_: MCHP MEMORY SERIAL EEPROM 2Kb I2C 24AA025E48T-I/OT SOT-23-6; Dev Tools Status: Production; Owner: Ciprian Abramov; Populated: YES; MCHP-ID: MIC7407; Symbol: 24XXXX SOT-23-6; Type: Serial EEPROM; Status: MCL Design; Revision: 1; Category: MCHP-Memory; ComponentLink1URL: https://www.microchip.com/sitesearch/search/Product%20and%20Development%20Tools/24AA025E48T-I/OT; ComponentLink1Description: SVN Datasheet; ComponentLink2Description: Local Datasheet; ComponentLink3URL: C:\ALTIUM_WORK\00001_MCHP-CDB\Library\LibraryRefs\24XXXX SOT-23-6.SchLib; ComponentLink3Description: Open Symbol; ComponentLink4URL: C:\ALTIUM_WORK\00001_MCHP-CDB\Library\Footprints\SOT-23-6.PcbLib; ComponentLink4Description: Open Footprint; ComponentLink5Description: Open Footprint 2; ComponentLink6Description: Open Footprint 3; ComponentLink7Description: Open Footprint 4; Supplier 1: Digi-Key; Supplier Part Number 1: 24AA025E48T-I/OTCT-ND; Operating Temperature: -40C to +85C; Quantity Override: 1
U8 = IC1918: Manufacturer 1: Macronix; MCHP-ID: IC1918; Description_: IC MEMORY MX30LF4G28AD-XKI IC FLASH 4GBIT VFBGA-63; Dev Tools Status: Production; Vin: 2.7V to 3.6V; Owner: Ciprian Abramov; Populated: YES; Value: MX30LF4G28AD-XKI; Revision: 1; Symbol: MX30LF4G28AD-XKI VFBGA-63; Status: MCL Design; Package: VFBGA-63; ComponentLink1URL: https://chn-vm-apps.microchip.com/mchprepo/parts/Datasheets/MX30LF4G28AD, 3V, 4Gb, v1.2.pdf; ComponentLink1Description: SVN Datasheet; ComponentLink2URL: C:\ALTIUM_WORK\00001_MCHP-CDB\Datasheets\MX30LF4G28AD, 3V, 4Gb, v1.2.pdf; ComponentLink2Description: Local Datasheet; ComponentLink3URL: C:\ALTIUM_WORK\00001_MCHP-CDB\Library\LibraryRefs\MX30LF4G28AD-XKI VFBGA-63.SchLib; ComponentLink3Description: Open Symbol; ComponentLink4URL: C:\ALTIUM_WORK\00001_MCHP-CDB\Library\Footprints\VFBGA-63_P0.8_9x11x1.PcbLib; ComponentLink4Description: Open Footprint; ComponentLink5Description: Open Footprint 2; ComponentLink6Description: Open Footprint 3; ComponentLink7Description: Open Footprint 4; Operating Temperature: -40C to +85C; Type: Memory; Category: IC; Manufacturer Part Number 1: MX30LF4G28AD-XKI; Supplier 1: Digi-Key; Supplier Part Number 1: 1092-MX30LF4G28AD-XKI-ND; Quantity Override: 1
U9 = MIC8649: SQI Serial Flash; Manufacturer 1: Microchip Technology; Description_: MCHP SERIAL FLASH SST26VF064BEUI-104I/MF WDFN-8; MAPS Description: 64Mb 2.3V to 3.6V SQI Flash Memory with EUI48 & EUI64 Mac Addresses; Dev Tools Status: Design; Owner: Dragos Danaila; MPC: S01027U3XEUI; PackingMedia: TUBE; TempRange: -40C to +85C; Stage: REL; LeadCount: 8; PackageWidth: 6x5x0.8mm; ForceMinOrderQtyMult: False; MinOrderQty: 0; LeadContent: Pb-FREE; Busmodes: SPI,SDI,SQI; MemorySize: 64Mb; OpVoltMin: 2,3; OpVoltMax: 3,6; MaxClockFreq: 104 MHz; PageSize_B: 256; WPScheme: Full Array; Endurance: 100,000; Populated: YES; MCHP-ID: MIC8649; Symbol: SST26VF064B-104IMF; Type: Serial Flash; Status: MCL Design; Revision: 1; Category: MCHP-Memory; ComponentLink1URL: http://www.microchip.com/wwwproducts/SST26VF064BEUI; ComponentLink1Description: SVN Datasheet; ComponentLink2Description: Local Datasheet; ComponentLink3URL: C:\ALTIUM_WORK\00001_MCHP-CDB\Library\LibraryRefs\SST26VF064B-104IMF.SchLib; ComponentLink3Description: Open Symbol; ComponentLink4URL: C:\ALTIUM_WORK\00001_MCHP-CDB\Library\Footprints\WSON-8_6x5_EP3.4X4.0.PcbLib; ComponentLink4Description: Open Footprint; ComponentLink5Description: Open Footprint 2; ComponentLink6Description: Open Footprint 3; ComponentLink7Description: Open Footprint 4; Manufacturer Part Number 1: SST26VF064BEUI-104I/MF; Supplier 1: Microchip Technology; Supplier Part Number 1: SST26VF064BEUI-104I/MF; PackageType: TDFN-S; IntroductionDate: 2019-04-11; Quantity Override: 1
U10 = MIC6596: LDO Regulator; Manufacturer 1: Microchip Technology; Manufacturer Part Number 1: MIC5219YMM; Description_: MCHP ANALOG LDO 2.5V-5V MIC5219YMM MSOP-8; Dev Tools Status: Production; Owner: Sorin Stanoaia; Populated: YES; MCHP-ID: MIC6596; Symbol: MIC5219 MSOP-8; Type: LDO; Status: MCL Design; Revision: 2; Category: MCHP-Analog; ComponentLink1URL: https://www.microchip.com/sitesearch/search/Product%20and%20Development%20Tools/MIC5219YMM; ComponentLink1Description: SVN Datasheet; ComponentLink2Description: Local Datasheet; ComponentLink3URL: C:\ALTIUM_WORK\00001_MCHP-CDB\Library\LibraryRefs\MIC5219 MSOP-8.SchLib; ComponentLink3Description: Open Symbol; ComponentLink4URL: C:\ALTIUM_WORK\00001_MCHP-CDB\Library\Footprints\MSOP-8.PcbLib; ComponentLink4Description: Open Footprint; ComponentLink5Description: Open Footprint 2; ComponentLink6Description: Open Footprint 3; ComponentLink7Description: Open Footprint 4; Supplier 1: Digi-Key; Supplier Part Number 1: 576-3437-ND; Operating Temperature: -40C to +125C; Quantity Override: 1
U11 = MIC8847: Manufacturer 1: Microchip Technology; Manufacturer Part Number 1: MIC94085YFT-TR; Description_: MCHP ANALOG POWER SWITCH 1.7V to 5.5V 2A MIC94085YFT 4-TMLF; Dev Tools Status: Design; Owner: Ciprian Abramov; Populated: YES; MCHP-ID: MIC8847; Symbol: MIC94085YFT MLF-4; Type: Power Switch; Status: MCL Design; Revision: 1; Category: MCHP-Analog; ComponentLink1Description: SVN Datasheet; ComponentLink2Description: Local Datasheet; ComponentLink3URL: C:\ALTIUM_WORK\00001_MCHP-CDB\Library\LibraryRefs\MIC94085YFT MLF-4.SchLib; ComponentLink3Description: Open Symbol; ComponentLink4URL: C:\ALTIUM_WORK\00001_MCHP-CDB\Library\Footprints\MLF-4 0.85X0.85mm.PcbLib; ComponentLink4Description: Open Footprint; ComponentLink5Description: Open Footprint 2; ComponentLink6Description: Open Footprint 3; ComponentLink7Description: Open Footprint 4; Supplier 1: Digi-Key; Supplier Part Number 1: 576-3345-1-ND; Quantity Override: 1